# Altium schematic sheet 3_audioConnectors.SchDoc
size A4
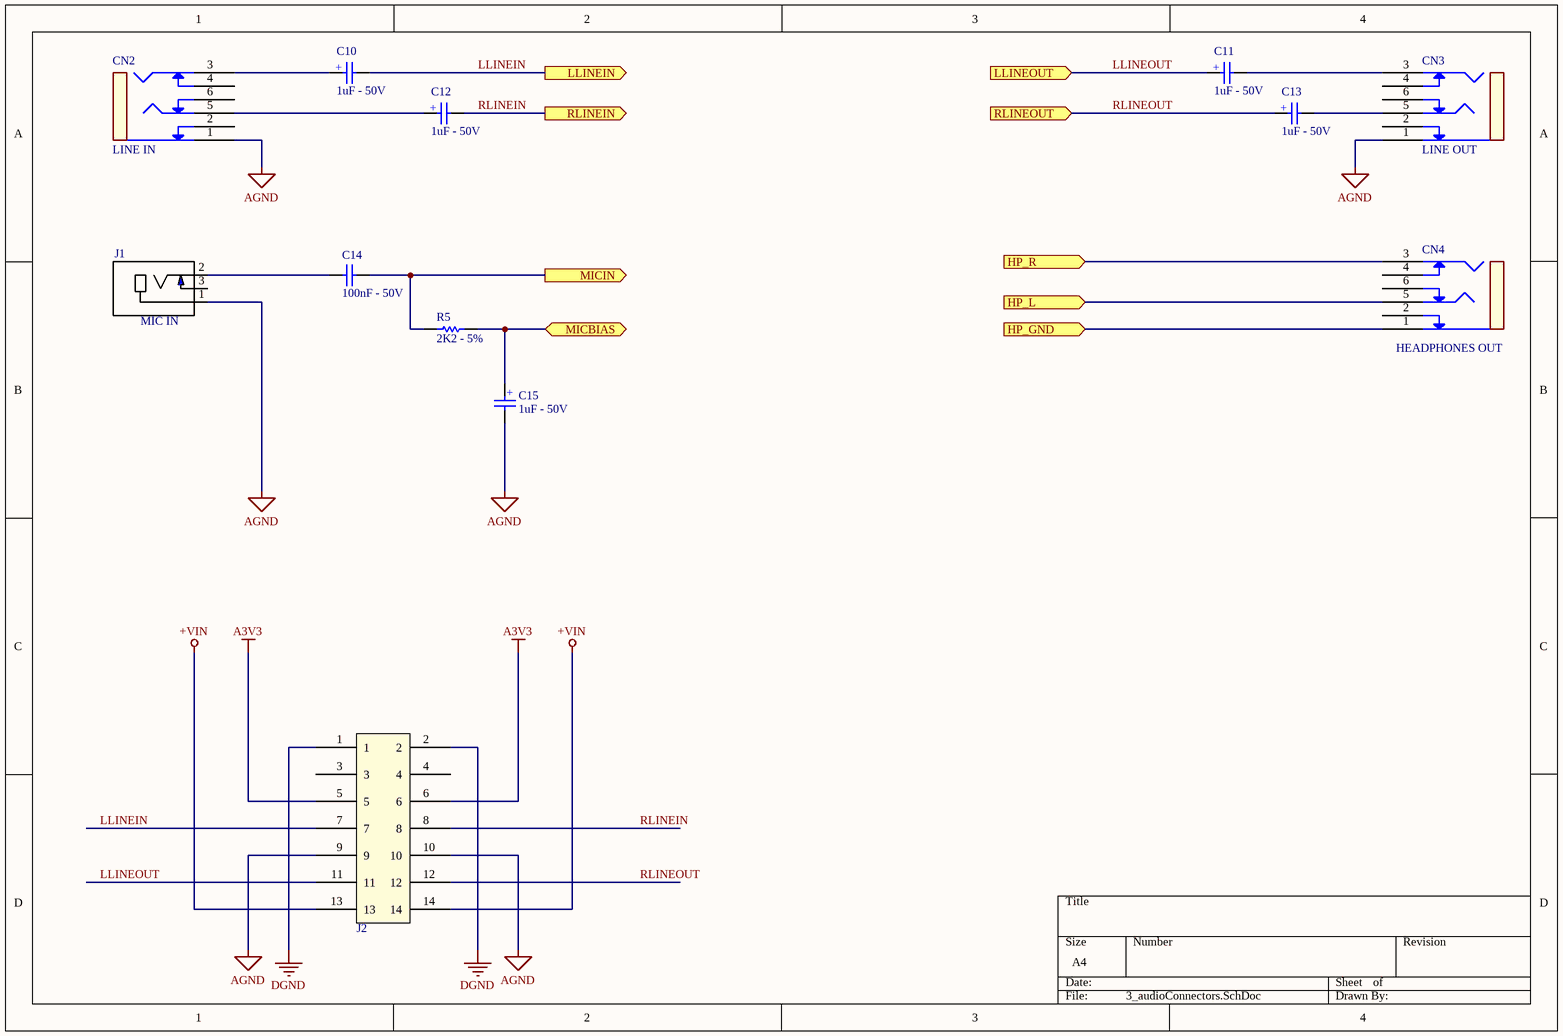
[diagram p0: 3_audioConnectors.SchDoc]

## Parts
C10  VALOR: 1uF - 50V  [CAP/SMD/ELET/5MM/NP]  (hidden comment: Capacitor 1 uF - 10%)
C11  VALOR: 1uF - 50V  [CAP/SMD/ELET/5MM/NP]  (hidden comment: Capacitor 1 uF - 10%)
C12  VALOR: 1uF - 50V  [CAP/SMD/ELET/5MM/NP]  (hidden comment: Capacitor 1 uF - 10%)
C13  VALOR: 1uF - 50V  [CAP/SMD/ELET/5MM/NP]  (hidden comment: Capacitor 1 uF - 10%)
C14  VALOR: 100nF - 50V  [SMD0805-CAP]  (hidden comment: Capacitor 100 nF - 10%)
C15  VALOR: 1uF - 50V  [CAP/SMD/ELET/5MM/NP]  (hidden comment: Capacitor 1 uF - 10%)
CN2  LINE IN  [CNC/P10/.080]
CN3  LINE OUT  [CNC/P10/.080]
CN4  HEADPHONES OUT  [CNC/P10/.080]
J1  value MIC IN  [CUI_MJ1-2510-SMT]  (hidden comment: MJ1-2510-SMT)
J2  BOARD SLOT CONNECTOR  [SLOT_CONN_BOARD]  (value not drawn)
R5  VALOR: 2K2 - 5%  [SMD0805]  (hidden comment: 2K2 - 5% - 0805 - 333)

## Ports
HP_GND (in), HP_L (in), HP_R (in), LLINEIN (out), LLINEOUT (in), MICBIAS (bidir), MICIN (out), RLINEIN (out), RLINEOUT (in)

## Nets
+VIN: J2.13 J2.14
A3V3: J2.5 J2.6
AGND: C15.1 CN2.1 CN3.1 J1.1 J2.9 J2.10
DGND: J2.1 J2.2
HP_GND: CN4.1 ; port HP_GND
HP_L: CN4.5 ; port HP_L
HP_R: CN4.3 ; port HP_R
LLINEIN: C10.1 J2.7 ; port LLINEIN
LLINEOUT: C11.2 J2.11 ; port LLINEOUT
MICBIAS: C15.2 R5.2 ; port MICBIAS
MICIN: C14.2 R5.1 ; port MICIN
RLINEIN: C12.1 J2.8 ; port RLINEIN
RLINEOUT: C13.2 J2.12 ; port RLINEOUT
NetC10_2: C10.2 CN2.3
NetC11_1: C11.1 CN3.3
NetC12_2: C12.2 CN2.5
NetC13_1: C13.1 CN3.5
NetC14_1: C14.1 J1.2

Not connected (* = marked no-connect by the designer): CN2 2 4 6; CN3 2 4 6; CN4 2 4 6; J1 3(4); J2 3 4

## Notes on the sheet
- (in symbol 1uF - 50V - 10% - 0805 - 3296) +

## Library data of the parts
C10-C13 C15 = 1uF - 50V - 10% - 0805 - 3296: Capacitor 1uF, 10%, SMD 0805; MANUFACTURER: AVX; PARTNUMBER: 08055C105KAT2A; CODIGO: 3296; EMBALAGEM: REEL; FORNECEDOR: VARIOS; DESC: CAP 1uF, 50V, SMD0805, 10%, X7R, CERAMICO MULTICAMADA; TARGET MÁX U$: $0,0507; ComponentLink1Description: Datasheet; ComponentLink1URL: http://www.tdk.com/pdf/general_B11.pdf; ComponentLink2Description: HOME TDK; ComponentLink2URL: http://www.tdk.com/; ENCAPSULAMENTO: SMD0805; FACTORY PACK: 3000; LOCALIZAÇÃO: *; Supplier 1: Mouser; Supplier Part Number 1: 08055C105KAT2A
C14 = 100nF - 50V - 10% - 0805 - 580: Capacitor 100nF, 10%, SMD 0805; MANUFACTURER: AVX; PARTNUMBER: 08055C104KAT2A; CODIGO: 580; EMBALAGEM: REEL; FORNECEDOR: VARIOS; DESC: CAP 100nF, 50V, SMD0805, 10%, X7R, CERAMICO MULTICAMADA; TARGET MÁX U$: $0,0041; ComponentLink1Description: Datasheet; ComponentLink1URL: http://www.avx.com/docs/catalogs/cx7r.pdf; ComponentLink2Description: HOME AVX; ComponentLink2URL: http://www.avx.com/; ENCAPSULAMENTO: SMD0805; FACTORY PACK: 4000; LOCALIZAÇÃO: *; Supplier 1: Mouser; Supplier Part Number 1: 08055C104KAT2A; NCM: 8532.21.11
CN2-CN4 = CNC JACK P10 ST P/ PCI, HORIZ, TP - 749: Conector JACK P10 ST P/ PC; DESC: CNC TRS 1/4", P10, JACK FEMEA, STEREO, HORIZONTAL, TP, P/ PCI, FE; CODIGO: 749; VALOR: Conector JACK P10 ST P/ PC; ComponentLinK1Description: Datasheet; ComponentLink1URL: *; ComponentLink2Description: *; ComponentLink2URL: *; EMBALAGEM: *; ENCAPSULAMENTO: *; FACTORY PACK: *; FORNECEDOR: *; LOCALIZAÇÃO: *; MANUFACTURER: *; PARTNUMBER: *; NCM: 8536.90.40
J2 = SLOT_MACHO: Conector de expansão colocado na borda da placa
R5 = 2K2 - 5% - 0805 - 333: Resistor 2K2, 5%, SMD 0805; PARTNUMBER: RC2012J222CS; MANUFACTURER: SAMSUNG; CODIGO: 333; EMBALAGEM: REEL; FORNECEDOR: VARIOS; DESC: RES 2K2, 5%, SMD 0805, MF; TARGET MÁX U$: $0.0015; LOCALIZAÇÃO: *; ENCAPSULAMENTO: SMD0805; FACTORY PACK: 5000; Supplier 1: AVNET; Supplier Part Number 1: RC2012J222CS; ComponentLink1Description: Datasheet; ComponentLink1URL: http://download.siliconexpert.com/pdfs/2011/2/28/4/59/40/979/sam_/manual/resistor-general1.pdf; ComponentLink2Description: HOME SAMSUNG; ComponentLink2URL: http://www.samsung.com/global/business/semiconductor/; NCM: 8533.21.20